# Altium project FPGA_board_controller.PrjPcb (part 2 of 2)
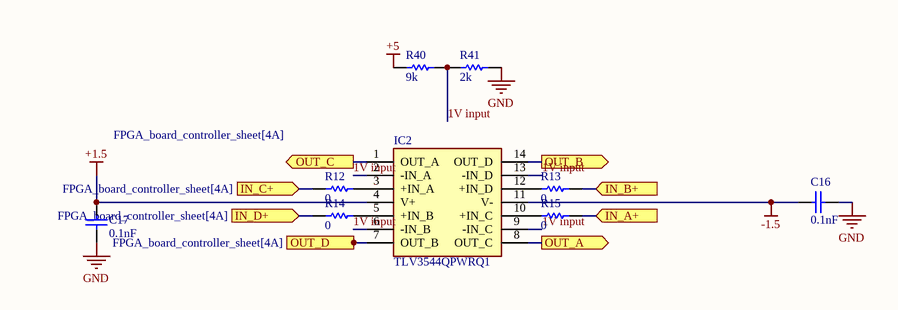
[diagram p4: op-amp.SchDoc]

## Nets that join several sheets
5V5: FPGA_board_controller_sheet (Con8.1), Power_Conversion_sheet (17 pins)
+5: Power_Conversion_sheet (8 pins), U_LDO1 (C12_1.2 PS1_1.3 R18_1.2 R19_1.2), U_LDO2 (C12_2.2 PS1_2.3 R18_2.2 R19_2.2), U_LDO3 (C12_3.2 PS1_3.3 R18_3.2 R19_3.2), U_LDO4 (C12_4.2 PS1_4.3 R18_4.2 R19_4.2), U_LDO5 (C12_5.2 PS1_5.3 R18_5.2 R19_5.2), U_LDO6 (C12_6.2 PS1_6.3 R18_6.2 R19_6.2), U_LDO7 (C12_7.2 PS1_7.3 R18_7.2 R19_7.2), U_LDO8 (C12_8.2 PS1_8.3 R18_8.2 R19_8.2), U_op-amp1 (R40_1.1), U_op-amp2 (R40_2.1), U_op-amp3 (R40_3.1), U_op-amp4 (R40_4.1), U_op-amp5 (R40_5.1), U_op-amp6 (R40_6.1), U_op-amp7 (R40_7.1), U_op-amp8 (R40_8.1), U_op-amp9 (R40_9.1), U_op-amp10 (R40_10.1), U_op-amp11 (R40_11.1), U_op-amp12 (R40_12.1), U_op-amp13 (R40_13.1), U_op-amp14 (R40_14.1), U_op-amp15 (R40_15.1), U_op-amp16 (R40_16.1), U_op-amp17 (R40_17.1), U_op-amp18 (R40_18.1), U_op-amp19 (R40_19.1), U_op-amp20 (R40_20.1), U_op-amp21 (R40_21.1), U_op-amp22 (R40_22.1), U_op-amp23 (R40_23.1), U_op-amp24 (R40_24.1), U_op-amp25 (R40_25.1), U_op-amp26 (R40_26.1), U_op-amp27 (R40_27.1), U_op-amp28 (R40_28.1), U_op-amp29 (R40_29.1), U_op-amp30 (R40_30.1), U_op-amp31 (R40_31.1), U_op-amp32 (R40_32.1), U_op-amp33 (R40_33.1), U_op-amp34 (R40_34.1), U_op-amp35 (R40_35.1), U_op-amp36 (R40_36.1), U_op-amp37 (R40_37.1), U_op-amp38 (R40_38.1), U_op-amp39 (R40_39.1), U_op-amp40 (R40_40.1)
GND: FPGA_board_controller_sheet (42 pins), Power_Conversion_sheet (37 pins), U_LDO1 (9 pins), U_LDO2 (9 pins), U_LDO3 (9 pins), U_LDO4 (9 pins), U_LDO5 (9 pins), U_LDO6 (9 pins), U_LDO7 (9 pins), U_LDO8 (9 pins), U_op-amp1 (C16_1.2 C17_1.1 R41_1.2), U_op-amp2 (C16_2.2 C17_2.1 R41_2.2), U_op-amp3 (C16_3.2 C17_3.1 R41_3.2), U_op-amp4 (C16_4.2 C17_4.1 R41_4.2), U_op-amp5 (C16_5.2 C17_5.1 R41_5.2), U_op-amp6 (C16_6.2 C17_6.1 R41_6.2), U_op-amp7 (C16_7.2 C17_7.1 R41_7.2), U_op-amp8 (C16_8.2 C17_8.1 R41_8.2), U_op-amp9 (C16_9.2 C17_9.1 R41_9.2), U_op-amp10 (C16_10.2 C17_10.1 R41_10.2), U_op-amp11 (C16_11.2 C17_11.1 R41_11.2), U_op-amp12 (C16_12.2 C17_12.1 R41_12.2), U_op-amp13 (C16_13.2 C17_13.1 R41_13.2), U_op-amp14 (C16_14.2 C17_14.1 R41_14.2), U_op-amp15 (C16_15.2 C17_15.1 R41_15.2), U_op-amp16 (C16_16.2 C17_16.1 R41_16.2), U_op-amp17 (C16_17.2 C17_17.1 R41_17.2), U_op-amp18 (C16_18.2 C17_18.1 R41_18.2), U_op-amp19 (C16_19.2 C17_19.1 R41_19.2), U_op-amp20 (C16_20.2 C17_20.1 R41_20.2), U_op-amp21 (C16_21.2 C17_21.1 R41_21.2), U_op-amp22 (C16_22.2 C17_22.1 R41_22.2), U_op-amp23 (C16_23.2 C17_23.1 R41_23.2), U_op-amp24 (C16_24.2 C17_24.1 R41_24.2), U_op-amp25 (C16_25.2 C17_25.1 R41_25.2), U_op-amp26 (C16_26.2 C17_26.1 R41_26.2), U_op-amp27 (C16_27.2 C17_27.1 R41_27.2), U_op-amp28 (C16_28.2 C17_28.1 R41_28.2), U_op-amp29 (C16_29.2 C17_29.1 R41_29.2), U_op-amp30 (C16_30.2 C17_30.1 R41_30.2), U_op-amp31 (C16_31.2 C17_31.1 R41_31.2), U_op-amp32 (C16_32.2 C17_32.1 R41_32.2), U_op-amp33 (C16_33.2 C17_33.1 R41_33.2), U_op-amp34 (C16_34.2 C17_34.1 R41_34.2), U_op-amp35 (C16_35.2 C17_35.1 R41_35.2), U_op-amp36 (C16_36.2 C17_36.1 R41_36.2), U_op-amp37 (C16_37.2 C17_37.1 R41_37.2), U_op-amp38 (C16_38.2 C17_38.1 R41_38.2), U_op-amp39 (C16_39.2 C17_39.1 R41_39.2), U_op-amp40 (C16_40.2 C17_40.1 R41_40.2)
OUT+: U_LDO1 (C11_1.2 PS1_1.11 R8_1.2), U_LDO2 (C11_2.2 PS1_2.11 R8_2.2), U_LDO3 (C11_3.2 PS1_3.11 R8_3.2), U_LDO4 (C11_4.2 PS1_4.11 R8_4.2), U_LDO5 (C11_5.2 PS1_5.11 R8_5.2), U_LDO6 (C11_6.2 PS1_6.11 R8_6.2), U_LDO7 (C11_7.2 PS1_7.11 R8_7.2), U_LDO8 (C11_8.2 PS1_8.11 R8_8.2), U_op-amp1 (C17_1.2 IC2_1.4), U_op-amp2 (C17_2.2 IC2_2.4), U_op-amp3 (C17_3.2 IC2_3.4), U_op-amp4 (C17_4.2 IC2_4.4), U_op-amp5 (C17_5.2 IC2_5.4), U_op-amp6 (C17_6.2 IC2_6.4), U_op-amp7 (C17_7.2 IC2_7.4), U_op-amp8 (C17_8.2 IC2_8.4), U_op-amp9 (C17_9.2 IC2_9.4), U_op-amp10 (C17_10.2 IC2_10.4), U_op-amp11 (C17_11.2 IC2_11.4), U_op-amp12 (C17_12.2 IC2_12.4), U_op-amp13 (C17_13.2 IC2_13.4), U_op-amp14 (C17_14.2 IC2_14.4), U_op-amp15 (C17_15.2 IC2_15.4), U_op-amp16 (C17_16.2 IC2_16.4), U_op-amp17 (C17_17.2 IC2_17.4), U_op-amp18 (C17_18.2 IC2_18.4), U_op-amp19 (C17_19.2 IC2_19.4), U_op-amp20 (C17_20.2 IC2_20.4), U_op-amp21 (C17_21.2 IC2_21.4), U_op-amp22 (C17_22.2 IC2_22.4), U_op-amp23 (C17_23.2 IC2_23.4), U_op-amp24 (C17_24.2 IC2_24.4), U_op-amp25 (C17_25.2 IC2_25.4), U_op-amp26 (C17_26.2 IC2_26.4), U_op-amp27 (C17_27.2 IC2_27.4), U_op-amp28 (C17_28.2 IC2_28.4), U_op-amp29 (C17_29.2 IC2_29.4), U_op-amp30 (C17_30.2 IC2_30.4), U_op-amp31 (C17_31.2 IC2_31.4), U_op-amp32 (C17_32.2 IC2_32.4), U_op-amp33 (C17_33.2 IC2_33.4), U_op-amp34 (C17_34.2 IC2_34.4), U_op-amp35 (C17_35.2 IC2_35.4), U_op-amp36 (C17_36.2 IC2_36.4), U_op-amp37 (C17_37.2 IC2_37.4), U_op-amp38 (C17_38.2 IC2_38.4), U_op-amp39 (C17_39.2 IC2_39.4), U_op-amp40 (C17_40.2 IC2_40.4)
OUT-: U_LDO1 (C15_1.1 PS1_1.6 R11_1.1), U_LDO2 (C15_2.1 PS1_2.6 R11_2.1), U_LDO3 (C15_3.1 PS1_3.6 R11_3.1), U_LDO4 (C15_4.1 PS1_4.6 R11_4.1), U_LDO5 (C15_5.1 PS1_5.6 R11_5.1), U_LDO6 (C15_6.1 PS1_6.6 R11_6.1), U_LDO7 (C15_7.1 PS1_7.6 R11_7.1), U_LDO8 (C15_8.1 PS1_8.6 R11_8.1), U_op-amp1 (C16_1.1 IC2_1.11), U_op-amp2 (C16_2.1 IC2_2.11), U_op-amp3 (C16_3.1 IC2_3.11), U_op-amp4 (C16_4.1 IC2_4.11), U_op-amp5 (C16_5.1 IC2_5.11), U_op-amp6 (C16_6.1 IC2_6.11), U_op-amp7 (C16_7.1 IC2_7.11), U_op-amp8 (C16_8.1 IC2_8.11), U_op-amp9 (C16_9.1 IC2_9.11), U_op-amp10 (C16_10.1 IC2_10.11), U_op-amp11 (C16_11.1 IC2_11.11), U_op-amp12 (C16_12.1 IC2_12.11), U_op-amp13 (C16_13.1 IC2_13.11), U_op-amp14 (C16_14.1 IC2_14.11), U_op-amp15 (C16_15.1 IC2_15.11), U_op-amp16 (C16_16.1 IC2_16.11), U_op-amp17 (C16_17.1 IC2_17.11), U_op-amp18 (C16_18.1 IC2_18.11), U_op-amp19 (C16_19.1 IC2_19.11), U_op-amp20 (C16_20.1 IC2_20.11), U_op-amp21 (C16_21.1 IC2_21.11), U_op-amp22 (C16_22.1 IC2_22.11), U_op-amp23 (C16_23.1 IC2_23.11), U_op-amp24 (C16_24.1 IC2_24.11), U_op-amp25 (C16_25.1 IC2_25.11), U_op-amp26 (C16_26.1 IC2_26.11), U_op-amp27 (C16_27.1 IC2_27.11), U_op-amp28 (C16_28.1 IC2_28.11), U_op-amp29 (C16_29.1 IC2_29.11), U_op-amp30 (C16_30.1 IC2_30.11), U_op-amp31 (C16_31.1 IC2_31.11), U_op-amp32 (C16_32.1 IC2_32.11), U_op-amp33 (C16_33.1 IC2_33.11), U_op-amp34 (C16_34.1 IC2_34.11), U_op-amp35 (C16_35.1 IC2_35.11), U_op-amp36 (C16_36.1 IC2_36.11), U_op-amp37 (C16_37.1 IC2_37.11), U_op-amp38 (C16_38.1 IC2_38.11), U_op-amp39 (C16_39.1 IC2_39.11), U_op-amp40 (C16_40.1 IC2_40.11)
IOA1: FPGA_board_controller_sheet (S1.5), U_op-amp1 (R15_1.2)
IOA2: FPGA_board_controller_sheet (S1.13), U_op-amp2 (R15_2.2)
IOA3: FPGA_board_controller_sheet (S1.21), U_op-amp3 (R15_3.2)
IOA4: FPGA_board_controller_sheet (S1.31), U_op-amp4 (R15_4.2)
IOA5: FPGA_board_controller_sheet (S1.39), U_op-amp5 (R15_5.2)
IOA6: FPGA_board_controller_sheet (S1.49), U_op-amp6 (R15_6.2)
IOA7: FPGA_board_controller_sheet (S1.57), U_op-amp7 (R15_7.2)
IOA8: FPGA_board_controller_sheet (S1.67), U_op-amp8 (R15_8.2)
IOA9: FPGA_board_controller_sheet (S1.75), U_op-amp9 (R15_9.2)
IOA10: FPGA_board_controller_sheet (S1.85), U_op-amp10 (R15_10.2)
IOA11: FPGA_board_controller_sheet (S1.93), U_op-amp11 (R15_11.2)
IOA12: FPGA_board_controller_sheet (S1.88), U_op-amp12 (R15_12.2)
IOA13: FPGA_board_controller_sheet (S1.80), U_op-amp13 (R15_13.2)
IOA14: FPGA_board_controller_sheet (S1.70), U_op-amp14 (R15_14.2)
IOA15: FPGA_board_controller_sheet (S1.62), U_op-amp15 (R15_15.2)
IOA16: FPGA_board_controller_sheet (S1.52), U_op-amp16 (R15_16.2)
IOA17: FPGA_board_controller_sheet (S1.44), U_op-amp17 (R15_17.2)
IOA18: FPGA_board_controller_sheet (S1.34), U_op-amp18 (R15_18.2)
IOA19: FPGA_board_controller_sheet (S1.26), U_op-amp19 (R15_19.2)
IOA20: FPGA_board_controller_sheet (S1.16), U_op-amp20 (R15_20.2)
IOA21: FPGA_board_controller_sheet (S1.8), U_op-amp21 (R15_21.2)
IOA22: FPGA_board_controller_sheet (S1.109), U_op-amp22 (R15_22.2)
IOA23: FPGA_board_controller_sheet (S1.117), U_op-amp23 (R15_23.2)
IOA24: FPGA_board_controller_sheet (S1.127), U_op-amp24 (R15_24.2)
IOA25: FPGA_board_controller_sheet (S1.135), U_op-amp25 (R15_25.2)
IOA26: FPGA_board_controller_sheet (S1.145), U_op-amp26 (R15_26.2)
IOA27: FPGA_board_controller_sheet (S1.153), U_op-amp27 (R15_27.2)
IOA28: FPGA_board_controller_sheet (S1.163), U_op-amp28 (R15_28.2)
IOA29: FPGA_board_controller_sheet (S1.171), U_op-amp29 (R15_29.2)
IOA30: FPGA_board_controller_sheet (S1.181), U_op-amp30 (R15_30.2)
IOA31: FPGA_board_controller_sheet (S1.189), U_op-amp31 (R15_31.2)
IOA32: FPGA_board_controller_sheet (S1.199), U_op-amp32 (R15_32.2)
IOA33: FPGA_board_controller_sheet (S1.192), U_op-amp33 (R15_33.2)
IOA34: FPGA_board_controller_sheet (S1.184), U_op-amp34 (R15_34.2)
IOA35: FPGA_board_controller_sheet (S1.174), U_op-amp35 (R15_35.2)
IOA36: FPGA_board_controller_sheet (S1.166), U_op-amp36 (R15_36.2)
IOA37: FPGA_board_controller_sheet (S1.156), U_op-amp37 (R15_37.2)
IOA38: FPGA_board_controller_sheet (S1.148), U_op-amp38 (R15_38.2)
IOA39: FPGA_board_controller_sheet (S1.138), U_op-amp39 (R15_39.2)
IOA40: FPGA_board_controller_sheet (S1.130), U_op-amp40 (R15_40.2)
IOB1: FPGA_board_controller_sheet (S1.7), U_op-amp1 (R13_1.2)
IOB2: FPGA_board_controller_sheet (S1.15), U_op-amp2 (R13_2.2)
IOB3: FPGA_board_controller_sheet (S1.25), U_op-amp3 (R13_3.2)
IOB4: FPGA_board_controller_sheet (S1.33), U_op-amp4 (R13_4.2)
IOB5: FPGA_board_controller_sheet (S1.43), U_op-amp5 (R13_5.2)
IOB6: FPGA_board_controller_sheet (S1.51), U_op-amp6 (R13_6.2)
IOB7: FPGA_board_controller_sheet (S1.61), U_op-amp7 (R13_7.2)
IOB8: FPGA_board_controller_sheet (S1.69), U_op-amp8 (R13_8.2)
IOB9: FPGA_board_controller_sheet (S1.79), U_op-amp9 (R13_9.2)
IOB10: FPGA_board_controller_sheet (S1.87), U_op-amp10 (R13_10.2)
IOB11: FPGA_board_controller_sheet (S1.94), U_op-amp11 (R13_11.2)
IOB12: FPGA_board_controller_sheet (S1.86), U_op-amp12 (R13_12.2)
IOB13: FPGA_board_controller_sheet (S1.76), U_op-amp13 (R13_13.2)
IOB14: FPGA_board_controller_sheet (S1.68), U_op-amp14 (R13_14.2)
IOB15: FPGA_board_controller_sheet (S1.58), U_op-amp15 (R13_15.2)
IOB16: FPGA_board_controller_sheet (S1.50), U_op-amp16 (R13_16.2)
IOB17: FPGA_board_controller_sheet (S1.40), U_op-amp17 (R13_17.2)
IOB18: FPGA_board_controller_sheet (S1.32), U_op-amp18 (R13_18.2)
IOB19: FPGA_board_controller_sheet (S1.22), U_op-amp19 (R13_19.2)
IOB20: FPGA_board_controller_sheet (S1.14), U_op-amp20 (R13_20.2)
IOB21: FPGA_board_controller_sheet (S1.6), U_op-amp21 (R13_21.2)
IOB22: FPGA_board_controller_sheet (S1.111), U_op-amp22 (R13_22.2)
IOB23: FPGA_board_controller_sheet (S1.119), U_op-amp23 (R13_23.2)
IOB24: FPGA_board_controller_sheet (S1.129), U_op-amp24 (R13_24.2)
IOB25: FPGA_board_controller_sheet (S1.137), U_op-amp25 (R13_25.2)
IOB26: FPGA_board_controller_sheet (S1.147), U_op-amp26 (R13_26.2)
IOB27: FPGA_board_controller_sheet (S1.155), U_op-amp27 (R13_27.2)
IOB28: FPGA_board_controller_sheet (S1.165), U_op-amp28 (R13_28.2)
IOB29: FPGA_board_controller_sheet (S1.173), U_op-amp29 (R13_29.2)
IOB30: FPGA_board_controller_sheet (S1.183), U_op-amp30 (R13_30.2)
IOB31: FPGA_board_controller_sheet (S1.191), U_op-amp31 (R13_31.2)
IOB32: FPGA_board_controller_sheet (S1.200), U_op-amp32 (R13_32.2)
IOB33: FPGA_board_controller_sheet (S1.190), U_op-amp33 (R13_33.2)
IOB34: FPGA_board_controller_sheet (S1.182), U_op-amp34 (R13_34.2)
IOB35: FPGA_board_controller_sheet (S1.172), U_op-amp35 (R13_35.2)
IOB36: FPGA_board_controller_sheet (S1.164), U_op-amp36 (R13_36.2)
IOB37: FPGA_board_controller_sheet (S1.154), U_op-amp37 (R13_37.2)
IOB38: FPGA_board_controller_sheet (S1.146), U_op-amp38 (R13_38.2)
IOB39: FPGA_board_controller_sheet (S1.136), U_op-amp39 (R13_39.2)
IOB40: FPGA_board_controller_sheet (S1.128), U_op-amp40 (R13_40.2)
IOC1: FPGA_board_controller_sheet (S1.9), U_op-amp1 (R12_1.1)
IOC2: FPGA_board_controller_sheet (S1.17), U_op-amp2 (R12_2.1)
IOC3: FPGA_board_controller_sheet (S1.27), U_op-amp3 (R12_3.1)
IOC4: FPGA_board_controller_sheet (S1.35), U_op-amp4 (R12_4.1)
IOC5: FPGA_board_controller_sheet (S1.45), U_op-amp5 (R12_5.1)
IOC6: FPGA_board_controller_sheet (S1.53), U_op-amp6 (R12_6.1)
IOC7: FPGA_board_controller_sheet (S1.63), U_op-amp7 (R12_7.1)
IOC8: FPGA_board_controller_sheet (S1.71), U_op-amp8 (R12_8.1)
IOC9: FPGA_board_controller_sheet (S1.81), U_op-amp9 (R12_9.1)
IOC10: FPGA_board_controller_sheet (S1.89), U_op-amp10 (R12_10.1)
IOC11: FPGA_board_controller_sheet (S1.92), U_op-amp11 (R12_11.1)
IOC12: FPGA_board_controller_sheet (S1.84), U_op-amp12 (R12_12.1)
IOC13: FPGA_board_controller_sheet (S1.74), U_op-amp13 (R12_13.1)
IOC14: FPGA_board_controller_sheet (S1.66), U_op-amp14 (R12_14.1)
IOC15: FPGA_board_controller_sheet (S1.56), U_op-amp15 (R12_15.1)
IOC16: FPGA_board_controller_sheet (S1.48), U_op-amp16 (R12_16.1)
IOC17: FPGA_board_controller_sheet (S1.38), U_op-amp17 (R12_17.1)
IOC18: FPGA_board_controller_sheet (S1.30), U_op-amp18 (R12_18.1)
IOC19: FPGA_board_controller_sheet (S1.20), U_op-amp19 (R12_19.1)
IOC20: FPGA_board_controller_sheet (S1.12), U_op-amp20 (R12_20.1)
IOC21: FPGA_board_controller_sheet (S1.105), U_op-amp21 (R12_21.1)
IOC22: FPGA_board_controller_sheet (S1.113), U_op-amp22 (R12_22.1)
IOC23: FPGA_board_controller_sheet (S1.121), U_op-amp23 (R12_23.1)
IOC24: FPGA_board_controller_sheet (S1.131), U_op-amp24 (R12_24.1)
IOC25: FPGA_board_controller_sheet (S1.139), U_op-amp25 (R12_25.1)
IOC26: FPGA_board_controller_sheet (S1.149), U_op-amp26 (R12_26.1)
IOC27: FPGA_board_controller_sheet (S1.157), U_op-amp27 (R12_27.1)
IOC28: FPGA_board_controller_sheet (S1.167), U_op-amp28 (R12_28.1)
IOC29: FPGA_board_controller_sheet (S1.175), U_op-amp29 (R12_29.1)
IOC30: FPGA_board_controller_sheet (S1.185), U_op-amp30 (R12_30.1)
IOC31: FPGA_board_controller_sheet (S1.193), U_op-amp31 (R12_31.1)
IOC32: FPGA_board_controller_sheet (S1.198), U_op-amp32 (R12_32.1)
IOC33: FPGA_board_controller_sheet (S1.188), U_op-amp33 (R12_33.1)
IOC34: FPGA_board_controller_sheet (S1.180), U_op-amp34 (R12_34.1)
IOC35: FPGA_board_controller_sheet (S1.170), U_op-amp35 (R12_35.1)
IOC36: FPGA_board_controller_sheet (S1.162), U_op-amp36 (R12_36.1)
IOC37: FPGA_board_controller_sheet (S1.152), U_op-amp37 (R12_37.1)
IOC38: FPGA_board_controller_sheet (S1.144), U_op-amp38 (R12_38.1)
IOC39: FPGA_board_controller_sheet (S1.134), U_op-amp39 (R12_39.1)
IOC40: FPGA_board_controller_sheet (S1.126), U_op-amp40 (R12_40.1)
IOD1: FPGA_board_controller_sheet (S1.11), U_op-amp1 (R14_1.1)
IOD2: FPGA_board_controller_sheet (S1.19), U_op-amp2 (R14_2.1)
IOD3: FPGA_board_controller_sheet (S1.29), U_op-amp3 (R14_3.1)
IOD4: FPGA_board_controller_sheet (S1.37), U_op-amp4 (R14_4.1)
IOD5: FPGA_board_controller_sheet (S1.47), U_op-amp5 (R14_5.1)
IOD6: FPGA_board_controller_sheet (S1.55), U_op-amp6 (R14_6.1)
IOD7: FPGA_board_controller_sheet (S1.65), U_op-amp7 (R14_7.1)
IOD8: FPGA_board_controller_sheet (S1.73), U_op-amp8 (R14_8.1)
IOD9: FPGA_board_controller_sheet (S1.83), U_op-amp9 (R14_9.1)
IOD10: FPGA_board_controller_sheet (S1.91), U_op-amp10 (R14_10.1)
IOD11: FPGA_board_controller_sheet (S1.90), U_op-amp11 (R14_11.1)
IOD12: FPGA_board_controller_sheet (S1.82), U_op-amp12 (R14_12.1)
IOD13: FPGA_board_controller_sheet (S1.72), U_op-amp13 (R14_13.1)
IOD14: FPGA_board_controller_sheet (S1.64), U_op-amp14 (R14_14.1)
IOD15: FPGA_board_controller_sheet (S1.54), U_op-amp15 (R14_15.1)
IOD16: FPGA_board_controller_sheet (S1.46), U_op-amp16 (R14_16.1)
IOD17: FPGA_board_controller_sheet (S1.36), U_op-amp17 (R14_17.1)
IOD18: FPGA_board_controller_sheet (S1.28), U_op-amp18 (R14_18.1)
IOD19: FPGA_board_controller_sheet (S1.18), U_op-amp19 (R14_19.1)
IOD20: FPGA_board_controller_sheet (S1.10), U_op-amp20 (R14_20.1)
IOD21: FPGA_board_controller_sheet (S1.107), U_op-amp21 (R14_21.1)
IOD22: FPGA_board_controller_sheet (S1.115), U_op-amp22 (R14_22.1)
IOD23: FPGA_board_controller_sheet (S1.125), U_op-amp23 (R14_23.1)
IOD24: FPGA_board_controller_sheet (S1.133), U_op-amp24 (R14_24.1)
IOD25: FPGA_board_controller_sheet (S1.143), U_op-amp25 (R14_25.1)
IOD26: FPGA_board_controller_sheet (S1.151), U_op-amp26 (R14_26.1)
IOD27: FPGA_board_controller_sheet (S1.161), U_op-amp27 (R14_27.1)
IOD28: FPGA_board_controller_sheet (S1.169), U_op-amp28 (R14_28.1)
IOD29: FPGA_board_controller_sheet (S1.179), U_op-amp29 (R14_29.1)
IOD30: FPGA_board_controller_sheet (S1.187), U_op-amp30 (R14_30.1)
IOD31: FPGA_board_controller_sheet (S1.197), U_op-amp31 (R14_31.1)
IOD32: FPGA_board_controller_sheet (S1.194), U_op-amp32 (R14_32.1)
IOD33: FPGA_board_controller_sheet (S1.186), U_op-amp33 (R14_33.1)
IOD34: FPGA_board_controller_sheet (S1.176), U_op-amp34 (R14_34.1)
IOD35: FPGA_board_controller_sheet (S1.168), U_op-amp35 (R14_35.1)
IOD36: FPGA_board_controller_sheet (S1.158), U_op-amp36 (R14_36.1)
IOD37: FPGA_board_controller_sheet (S1.150), U_op-amp37 (R14_37.1)
IOD38: FPGA_board_controller_sheet (S1.140), U_op-amp38 (R14_38.1)
IOD39: FPGA_board_controller_sheet (S1.132), U_op-amp39 (R14_39.1)
IOD40: FPGA_board_controller_sheet (S1.122), U_op-amp40 (R14_40.1)
OUTA1: FPGA_board_controller_sheet (Con3.5), U_op-amp1 (IC2_1.8)
OUTA2: FPGA_board_controller_sheet (Con3.21), U_op-amp2 (IC2_2.8)
OUTA3: FPGA_board_controller_sheet (Con3.37), U_op-amp3 (IC2_3.8)
OUTA4: FPGA_board_controller_sheet (Con4.13), U_op-amp4 (IC2_4.8)
OUTA5: FPGA_board_controller_sheet (Con4.29), U_op-amp5 (IC2_5.8)
OUTA6: FPGA_board_controller_sheet (Con3.13), U_op-amp6 (IC2_6.8)
OUTA7: FPGA_board_controller_sheet (Con3.29), U_op-amp7 (IC2_7.8)
OUTA8: FPGA_board_controller_sheet (Con4.5), U_op-amp8 (IC2_8.8)
OUTA9: FPGA_board_controller_sheet (Con4.21), U_op-amp9 (IC2_9.8)
OUTA10: FPGA_board_controller_sheet (Con4.37), U_op-amp10 (IC2_10.8)
OUTA11: FPGA_board_controller_sheet (Con6.37), U_op-amp11 (IC2_11.8)
OUTA12: FPGA_board_controller_sheet (Con6.21), U_op-amp12 (IC2_12.8)
OUTA13: FPGA_board_controller_sheet (Con6.5), U_op-amp13 (IC2_13.8)
OUTA14: FPGA_board_controller_sheet (Con5.29), U_op-amp14 (IC2_14.8)
OUTA15: FPGA_board_controller_sheet (Con5.13), U_op-amp15 (IC2_15.8)
OUTA16: FPGA_board_controller_sheet (Con6.29), U_op-amp16 (IC2_16.8)
OUTA17: FPGA_board_controller_sheet (Con6.13), U_op-amp17 (IC2_17.8)
OUTA18: FPGA_board_controller_sheet (Con5.37), U_op-amp18 (IC2_18.8)
OUTA19: FPGA_board_controller_sheet (Con5.21), U_op-amp19 (IC2_19.8)
OUTA20: FPGA_board_controller_sheet (Con5.5), U_op-amp20 (IC2_20.8)
OUTA21: FPGA_board_controller_sheet (Con3.9), U_op-amp21 (IC2_21.8)
OUTA22: FPGA_board_controller_sheet (Con3.25), U_op-amp22 (IC2_22.8)
OUTA23: FPGA_board_controller_sheet (Con3.41), U_op-amp23 (IC2_23.8)
OUTA24: FPGA_board_controller_sheet (Con4.17), U_op-amp24 (IC2_24.8)
OUTA25: FPGA_board_controller_sheet (Con4.33), U_op-amp25 (IC2_25.8)
OUTA26: FPGA_board_controller_sheet (Con3.17), U_op-amp26 (IC2_26.8)
OUTA27: FPGA_board_controller_sheet (Con3.33), U_op-amp27 (IC2_27.8)
OUTA28: FPGA_board_controller_sheet (Con4.9), U_op-amp28 (IC2_28.8)
OUTA29: FPGA_board_controller_sheet (Con4.25), U_op-amp29 (IC2_29.8)
OUTA30: FPGA_board_controller_sheet (Con4.41), U_op-amp30 (IC2_30.8)
OUTA31: FPGA_board_controller_sheet (Con6.41), U_op-amp31 (IC2_31.8)
OUTA32: FPGA_board_controller_sheet (Con6.25), U_op-amp32 (IC2_32.8)
OUTA33: FPGA_board_controller_sheet (Con6.9), U_op-amp33 (IC2_33.8)
OUTA34: FPGA_board_controller_sheet (Con5.33), U_op-amp34 (IC2_34.8)
OUTA35: FPGA_board_controller_sheet (Con5.17), U_op-amp35 (IC2_35.8)
OUTA36: FPGA_board_controller_sheet (Con6.33), U_op-amp36 (IC2_36.8)
OUTA37: FPGA_board_controller_sheet (Con6.17), U_op-amp37 (IC2_37.8)
OUTA38: FPGA_board_controller_sheet (Con5.41), U_op-amp38 (IC2_38.8)
OUTA39: FPGA_board_controller_sheet (Con5.25), U_op-amp39 (IC2_39.8)
OUTA40: FPGA_board_controller_sheet (Con5.9), U_op-amp40 (IC2_40.8)
OUTB1: FPGA_board_controller_sheet (Con3.6), U_op-amp1 (IC2_1.14)
OUTB2: FPGA_board_controller_sheet (Con3.22), U_op-amp2 (IC2_2.14)
OUTB3: FPGA_board_controller_sheet (Con3.38), U_op-amp3 (IC2_3.14)
OUTB4: FPGA_board_controller_sheet (Con4.14), U_op-amp4 (IC2_4.14)
OUTB5: FPGA_board_controller_sheet (Con4.30), U_op-amp5 (IC2_5.14)
OUTB6: FPGA_board_controller_sheet (Con3.14), U_op-amp6 (IC2_6.14)
OUTB7: FPGA_board_controller_sheet (Con3.30), U_op-amp7 (IC2_7.14)
OUTB8: FPGA_board_controller_sheet (Con4.6), U_op-amp8 (IC2_8.14)
OUTB9: FPGA_board_controller_sheet (Con4.22), U_op-amp9 (IC2_9.14)
OUTB10: FPGA_board_controller_sheet (Con4.38), U_op-amp10 (IC2_10.14)
OUTB11: FPGA_board_controller_sheet (Con6.38), U_op-amp11 (IC2_11.14)
OUTB12: FPGA_board_controller_sheet (Con6.22), U_op-amp12 (IC2_12.14)
OUTB13: FPGA_board_controller_sheet (Con6.6), U_op-amp13 (IC2_13.14)
OUTB14: FPGA_board_controller_sheet (Con5.30), U_op-amp14 (IC2_14.14)
OUTB15: FPGA_board_controller_sheet (Con5.14), U_op-amp15 (IC2_15.14)
OUTB16: FPGA_board_controller_sheet (Con6.30), U_op-amp16 (IC2_16.14)
OUTB17: FPGA_board_controller_sheet (Con6.14), U_op-amp17 (IC2_17.14)
OUTB18: FPGA_board_controller_sheet (Con5.38), U_op-amp18 (IC2_18.14)
OUTB19: FPGA_board_controller_sheet (Con5.22), U_op-amp19 (IC2_19.14)
OUTB20: FPGA_board_controller_sheet (Con5.6), U_op-amp20 (IC2_20.14)
OUTB21: FPGA_board_controller_sheet (Con3.10), U_op-amp21 (IC2_21.14)
OUTB22: FPGA_board_controller_sheet (Con3.26), U_op-amp22 (IC2_22.14)
OUTB23: FPGA_board_controller_sheet (Con3.42), U_op-amp23 (IC2_23.14)
OUTB24: FPGA_board_controller_sheet (Con4.18), U_op-amp24 (IC2_24.14)
OUTB25: FPGA_board_controller_sheet (Con4.34), U_op-amp25 (IC2_25.14)
OUTB26: FPGA_board_controller_sheet (Con3.18), U_op-amp26 (IC2_26.14)
OUTB27: FPGA_board_controller_sheet (Con3.34), U_op-amp27 (IC2_27.14)
OUTB28: FPGA_board_controller_sheet (Con4.10), U_op-amp28 (IC2_28.14)
OUTB29: FPGA_board_controller_sheet (Con4.26), U_op-amp29 (IC2_29.14)
OUTB30: FPGA_board_controller_sheet (Con4.42), U_op-amp30 (IC2_30.14)
OUTB31: FPGA_board_controller_sheet (Con6.42), U_op-amp31 (IC2_31.14)
OUTB32: FPGA_board_controller_sheet (Con6.26), U_op-amp32 (IC2_32.14)
OUTB33: FPGA_board_controller_sheet (Con6.10), U_op-amp33 (IC2_33.14)
OUTB34: FPGA_board_controller_sheet (Con5.34), U_op-amp34 (IC2_34.14)
OUTB35: FPGA_board_controller_sheet (Con5.18), U_op-amp35 (IC2_35.14)
OUTB36: FPGA_board_controller_sheet (Con6.34), U_op-amp36 (IC2_36.14)
OUTB37: FPGA_board_controller_sheet (Con6.18), U_op-amp37 (IC2_37.14)
OUTB38: FPGA_board_controller_sheet (Con5.42), U_op-amp38 (IC2_38.14)
OUTB39: FPGA_board_controller_sheet (Con5.26), U_op-amp39 (IC2_39.14)
OUTB40: FPGA_board_controller_sheet (Con5.10), U_op-amp40 (IC2_40.14)
OUTC1: FPGA_board_controller_sheet (Con3.3), U_op-amp1 (IC2_1.1)
OUTC2: FPGA_board_controller_sheet (Con3.19), U_op-amp2 (IC2_2.1)
OUTC3: FPGA_board_controller_sheet (Con3.35), U_op-amp3 (IC2_3.1)
OUTC4: FPGA_board_controller_sheet (Con4.11), U_op-amp4 (IC2_4.1)
OUTC5: FPGA_board_controller_sheet (Con4.27), U_op-amp5 (IC2_5.1)
OUTC6: FPGA_board_controller_sheet (Con3.11), U_op-amp6 (IC2_6.1)
OUTC7: FPGA_board_controller_sheet (Con3.27), U_op-amp7 (IC2_7.1)
OUTC8: FPGA_board_controller_sheet (Con4.3), U_op-amp8 (IC2_8.1)
OUTC9: FPGA_board_controller_sheet (Con4.19), U_op-amp9 (IC2_9.1)
OUTC10: FPGA_board_controller_sheet (Con4.35), U_op-amp10 (IC2_10.1)
OUTC11: FPGA_board_controller_sheet (Con6.35), U_op-amp11 (IC2_11.1)
OUTC12: FPGA_board_controller_sheet (Con6.19), U_op-amp12 (IC2_12.1)
OUTC13: FPGA_board_controller_sheet (Con6.3), U_op-amp13 (IC2_13.1)
OUTC14: FPGA_board_controller_sheet (Con5.27), U_op-amp14 (IC2_14.1)
OUTC15: FPGA_board_controller_sheet (Con5.11), U_op-amp15 (IC2_15.1)
OUTC16: FPGA_board_controller_sheet (Con6.27), U_op-amp16 (IC2_16.1)
OUTC17: FPGA_board_controller_sheet (Con6.11), U_op-amp17 (IC2_17.1)
OUTC18: FPGA_board_controller_sheet (Con5.35), U_op-amp18 (IC2_18.1)
OUTC19: FPGA_board_controller_sheet (Con5.19), U_op-amp19 (IC2_19.1)
OUTC20: FPGA_board_controller_sheet (Con5.3), U_op-amp20 (IC2_20.1)
OUTC21: FPGA_board_controller_sheet (Con3.7), U_op-amp21 (IC2_21.1)
OUTC22: FPGA_board_controller_sheet (Con3.23), U_op-amp22 (IC2_22.1)
OUTC23: FPGA_board_controller_sheet (Con3.39), U_op-amp23 (IC2_23.1)
OUTC24: FPGA_board_controller_sheet (Con4.15), U_op-amp24 (IC2_24.1)
OUTC25: FPGA_board_controller_sheet (Con4.31), U_op-amp25 (IC2_25.1)
OUTC26: FPGA_board_controller_sheet (Con3.15), U_op-amp26 (IC2_26.1)
OUTC27: FPGA_board_controller_sheet (Con3.31), U_op-amp27 (IC2_27.1)
OUTC28: FPGA_board_controller_sheet (Con4.7), U_op-amp28 (IC2_28.1)
OUTC29: FPGA_board_controller_sheet (Con4.23), U_op-amp29 (IC2_29.1)
OUTC30: FPGA_board_controller_sheet (Con4.39), U_op-amp30 (IC2_30.1)
OUTC31: FPGA_board_controller_sheet (Con6.39), U_op-amp31 (IC2_31.1)
OUTC32: FPGA_board_controller_sheet (Con6.23), U_op-amp32 (IC2_32.1)
OUTC33: FPGA_board_controller_sheet (Con6.7), U_op-amp33 (IC2_33.1)
OUTC34: FPGA_board_controller_sheet (Con5.31), U_op-amp34 (IC2_34.1)
OUTC35: FPGA_board_controller_sheet (Con5.15), U_op-amp35 (IC2_35.1)
OUTC36: FPGA_board_controller_sheet (Con6.31), U_op-amp36 (IC2_36.1)
OUTC37: FPGA_board_controller_sheet (Con6.15), U_op-amp37 (IC2_37.1)
OUTC38: FPGA_board_controller_sheet (Con5.39), U_op-amp38 (IC2_38.1)
OUTC39: FPGA_board_controller_sheet (Con5.23), U_op-amp39 (IC2_39.1)
OUTC40: FPGA_board_controller_sheet (Con5.7), U_op-amp40 (IC2_40.1)
OUTD1: FPGA_board_controller_sheet (Con3.4), U_op-amp1 (IC2_1.7)
OUTD2: FPGA_board_controller_sheet (Con3.20), U_op-amp2 (IC2_2.7)
OUTD3: FPGA_board_controller_sheet (Con3.36), U_op-amp3 (IC2_3.7)
OUTD4: FPGA_board_controller_sheet (Con4.12), U_op-amp4 (IC2_4.7)
OUTD5: FPGA_board_controller_sheet (Con4.28), U_op-amp5 (IC2_5.7)
OUTD6: FPGA_board_controller_sheet (Con3.12), U_op-amp6 (IC2_6.7)
OUTD7: FPGA_board_controller_sheet (Con3.28), U_op-amp7 (IC2_7.7)
OUTD8: FPGA_board_controller_sheet (Con4.4), U_op-amp8 (IC2_8.7)
OUTD9: FPGA_board_controller_sheet (Con4.20), U_op-amp9 (IC2_9.7)
OUTD10: FPGA_board_controller_sheet (Con4.36), U_op-amp10 (IC2_10.7)
OUTD11: FPGA_board_controller_sheet (Con6.36), U_op-amp11 (IC2_11.7)
OUTD12: FPGA_board_controller_sheet (Con6.20), U_op-amp12 (IC2_12.7)
OUTD13: FPGA_board_controller_sheet (Con6.4), U_op-amp13 (IC2_13.7)
OUTD14: FPGA_board_controller_sheet (Con5.28), U_op-amp14 (IC2_14.7)
OUTD15: FPGA_board_controller_sheet (Con5.12), U_op-amp15 (IC2_15.7)
OUTD16: FPGA_board_controller_sheet (Con6.28), U_op-amp16 (IC2_16.7)
OUTD17: FPGA_board_controller_sheet (Con6.12), U_op-amp17 (IC2_17.7)
OUTD18: FPGA_board_controller_sheet (Con5.36), U_op-amp18 (IC2_18.7)
OUTD19: FPGA_board_controller_sheet (Con5.20), U_op-amp19 (IC2_19.7)
OUTD20: FPGA_board_controller_sheet (Con5.4), U_op-amp20 (IC2_20.7)
OUTD21: FPGA_board_controller_sheet (Con3.8), U_op-amp21 (IC2_21.7)
OUTD22: FPGA_board_controller_sheet (Con3.24), U_op-amp22 (IC2_22.7)
OUTD23: FPGA_board_controller_sheet (Con3.40), U_op-amp23 (IC2_23.7)
OUTD24: FPGA_board_controller_sheet (Con4.16), U_op-amp24 (IC2_24.7)
OUTD25: FPGA_board_controller_sheet (Con4.32), U_op-amp25 (IC2_25.7)
OUTD26: FPGA_board_controller_sheet (Con3.16), U_op-amp26 (IC2_26.7)
OUTD27: FPGA_board_controller_sheet (Con3.32), U_op-amp27 (IC2_27.7)
OUTD28: FPGA_board_controller_sheet (Con4.8), U_op-amp28 (IC2_28.7)
OUTD29: FPGA_board_controller_sheet (Con4.24), U_op-amp29 (IC2_29.7)
OUTD30: FPGA_board_controller_sheet (Con4.40), U_op-amp30 (IC2_30.7)
OUTD31: FPGA_board_controller_sheet (Con6.40), U_op-amp31 (IC2_31.7)
OUTD32: FPGA_board_controller_sheet (Con6.24), U_op-amp32 (IC2_32.7)
OUTD33: FPGA_board_controller_sheet (Con6.8), U_op-amp33 (IC2_33.7)
OUTD34: FPGA_board_controller_sheet (Con5.32), U_op-amp34 (IC2_34.7)
OUTD35: FPGA_board_controller_sheet (Con5.16), U_op-amp35 (IC2_35.7)
OUTD36: FPGA_board_controller_sheet (Con6.32), U_op-amp36 (IC2_36.7)
OUTD37: FPGA_board_controller_sheet (Con6.16), U_op-amp37 (IC2_37.7)
OUTD38: FPGA_board_controller_sheet (Con5.40), U_op-amp38 (IC2_38.7)
OUTD39: FPGA_board_controller_sheet (Con5.24), U_op-amp39 (IC2_39.7)
OUTD40: FPGA_board_controller_sheet (Con5.8), U_op-amp40 (IC2_40.7)